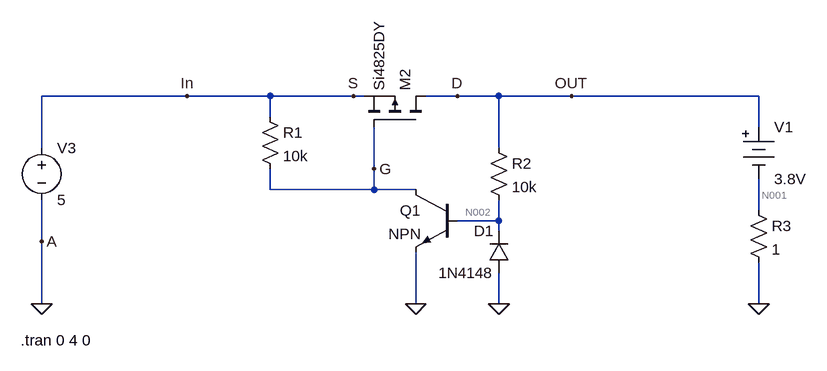
[diagram p0: schematic reverse_voltage_protection.lnk.asc]
reverse_voltage_protection.lnk.asc, the LTspice schematic file:
Version 4
SHEET 1 1220 724
WIRE 160 64 -64 64
WIRE 288 64 160 64
WIRE 416 64 288 64
WIRE 432 64 416 64
WIRE 576 64 528 64
WIRE 640 64 576 64
WIRE 752 64 640 64
WIRE 1040 64 752 64
WIRE 288 96 288 64
WIRE 1040 112 1040 64
WIRE -64 144 -64 64
WIRE 640 144 640 64
WIRE 448 176 448 112
WIRE 288 208 288 176
WIRE 448 208 448 176
WIRE 448 208 288 208
WIRE 512 208 448 208
WIRE 1040 240 1040 192
WIRE 640 256 640 224
WIRE 640 256 576 256
WIRE 640 272 640 256
WIRE -64 288 -64 224
WIRE -64 384 -64 288
WIRE 512 384 512 304
WIRE 640 384 640 336
WIRE 1040 384 1040 320
FLAG -64 384 0
FLAG 160 64 In
FLAG 416 64 S
FLAG 576 64 D
FLAG 448 176 G
FLAG 512 384 0
FLAG 640 384 0
FLAG 1040 384 0
FLAG 752 64 OUT
FLAG -64 288 A
SYMBOL pmos 528 112 M270
SYMATTR InstName M2
SYMATTR Value Si4825DY
SYMBOL voltage -64 128 R0
SYMATTR InstName V3
SYMATTR Value 5
SYMBOL res 272 80 R0
SYMATTR InstName R1
SYMATTR Value 10k
SYMBOL res 624 128 R0
SYMATTR InstName R2
SYMATTR Value 10k
SYMBOL npn 576 208 M0
SYMATTR InstName Q1
SYMBOL diode 656 336 R180
WINDOW 0 24 64 Left 2
WINDOW 3 24 0 Left 2
SYMATTR InstName D1
SYMATTR Value 1N4148
SYMBOL Misc\\battery 1040 96 R0
SYMATTR InstName V1
SYMATTR Value 3.8V
SYMBOL res 1024 224 R0
SYMATTR InstName R3
SYMATTR Value 1
TEXT -96 440 Left 2 !.tran 0 4 0

The netlist it stands for:
* reverse_voltage_protection.lnk.asc
M2 OUT G S S Si4825DY
V3 S 0 5
R1 S G 10k
R2 OUT N002 10k
Q1 G N002 0 0 NPN
D1 0 N002 1N4148
V1 OUT N001 3.8V
R3 N001 0 1
.model D D
.lib standard.dio
.model NPN NPN
.model PNP PNP
.lib standard.bjt
.model NMOS NMOS
.model PMOS PMOS
.lib standard.mos
.tran 0 4 0
.backanno
.end

* Results of the author's LTspice run, read from the files saved beside the schematic
* Operating Point, zero values left out:
*   V(out) = 4.977 V
*   V(g) = 30.27 mV
*   V(s) = 5 V
*   V(n002) = 781.2 mV
*   V(n001) = 1.177 V
*   Ic(Q1) = 497 µA
*   Ib(Q1) = 419.6 µA
*   Ie(Q1) = -916.6 µA
*   Id(M2) = -1.178 A
*   Is(M2) = 1.178 A
*   I(D1) = -2.521 nA
*   I(R3) = 1.177 A
*   I(R2) = 419.6 µA
*   I(R1) = 497 µA
*   I(V1) = 1.177 A
*   I(V3) = -1.178 A